# EAGLE design das_updated_v7 (EAGLE 9.6.2)
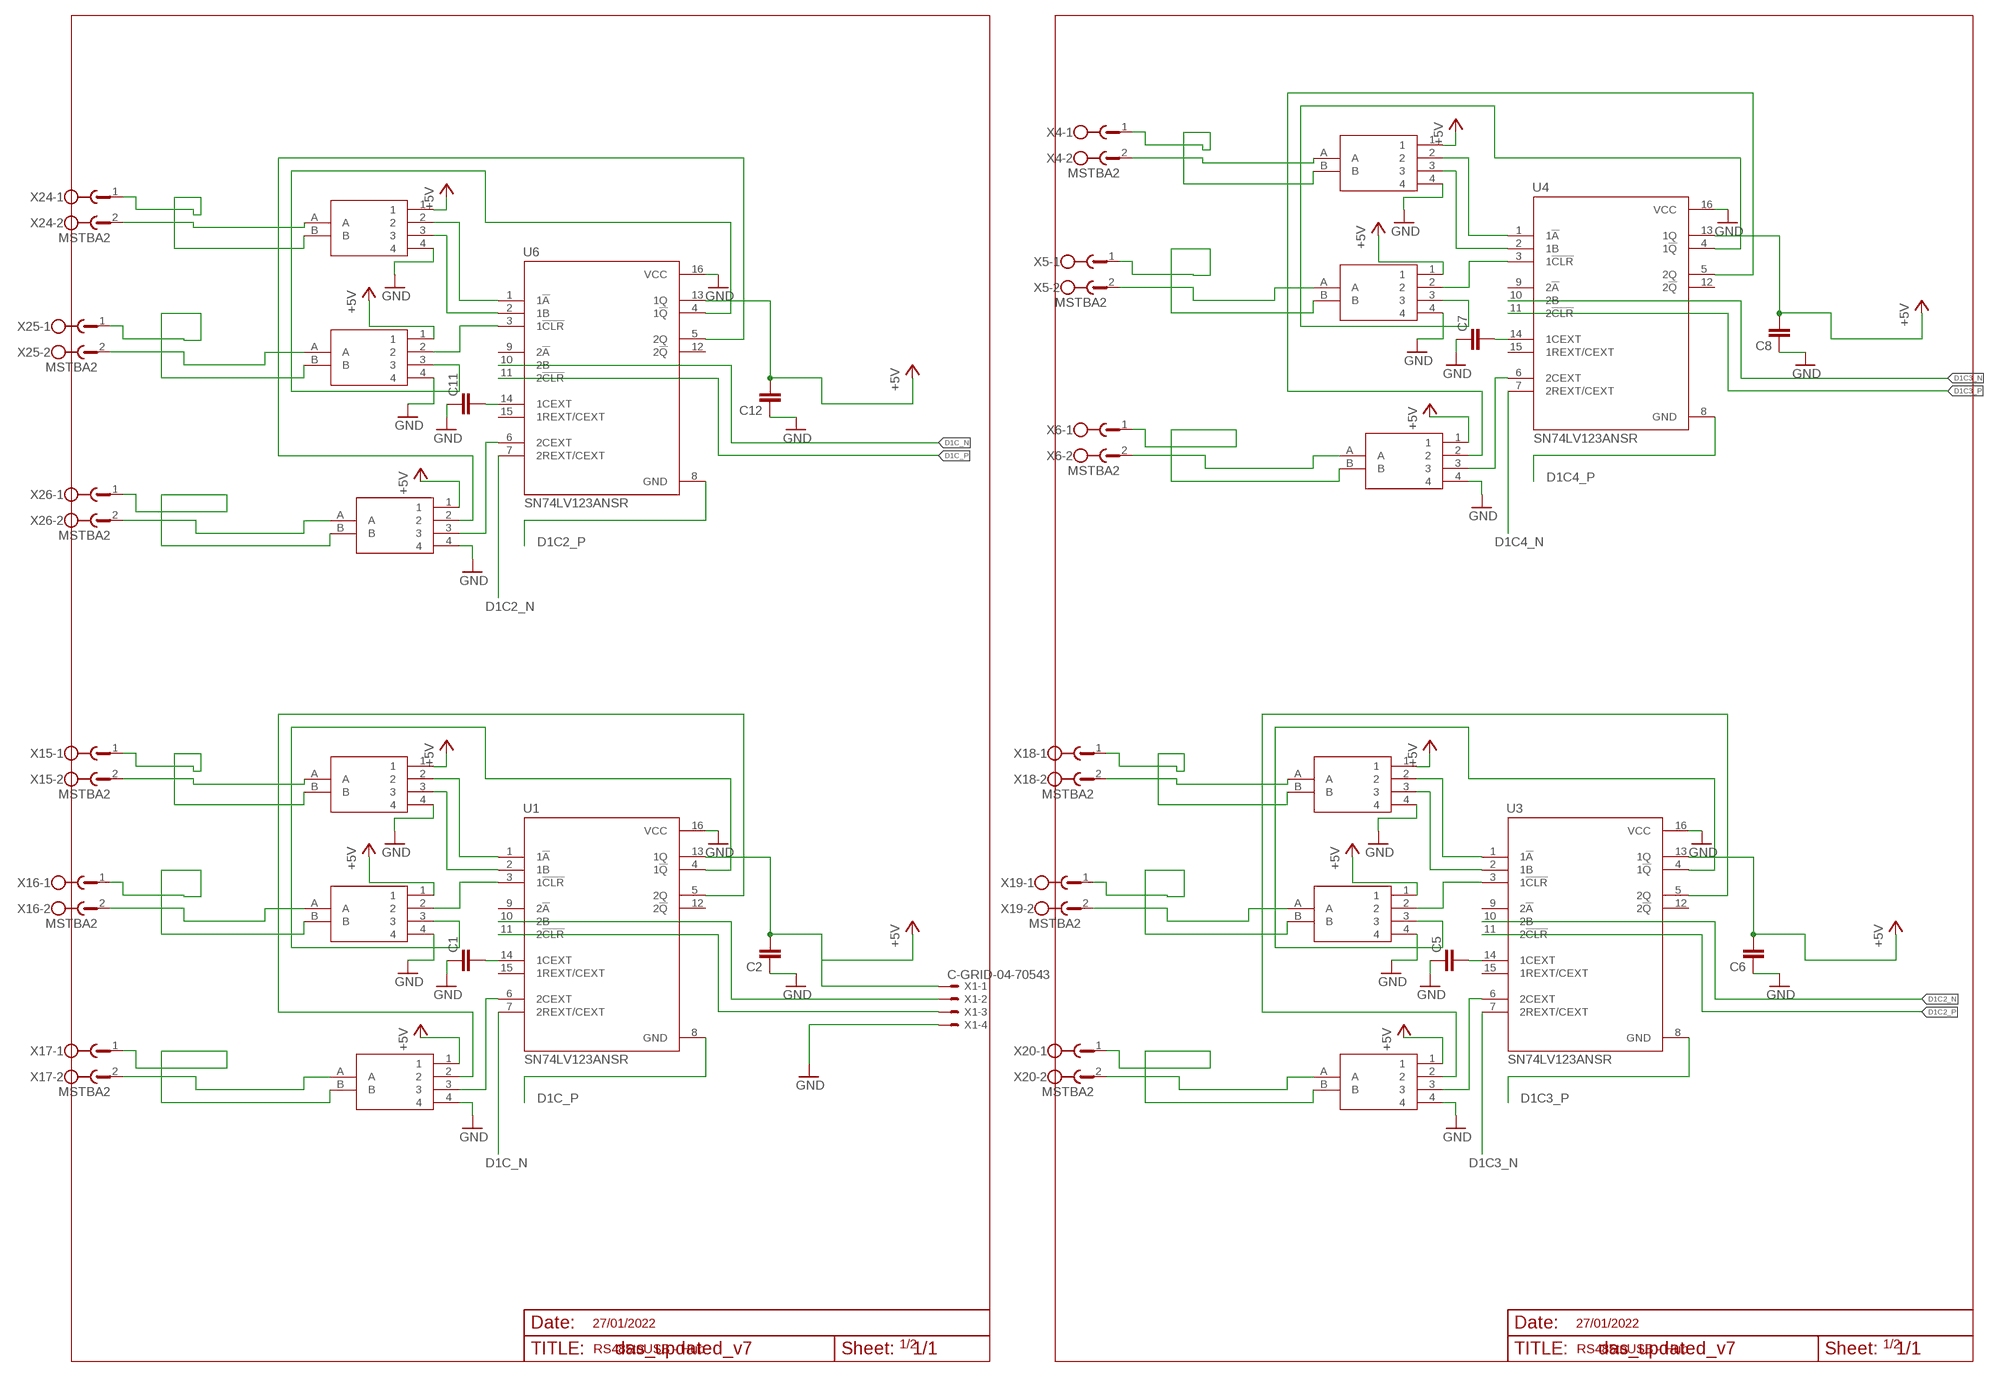
[diagram p0: schematic, sheet 1, part 1 of 2]
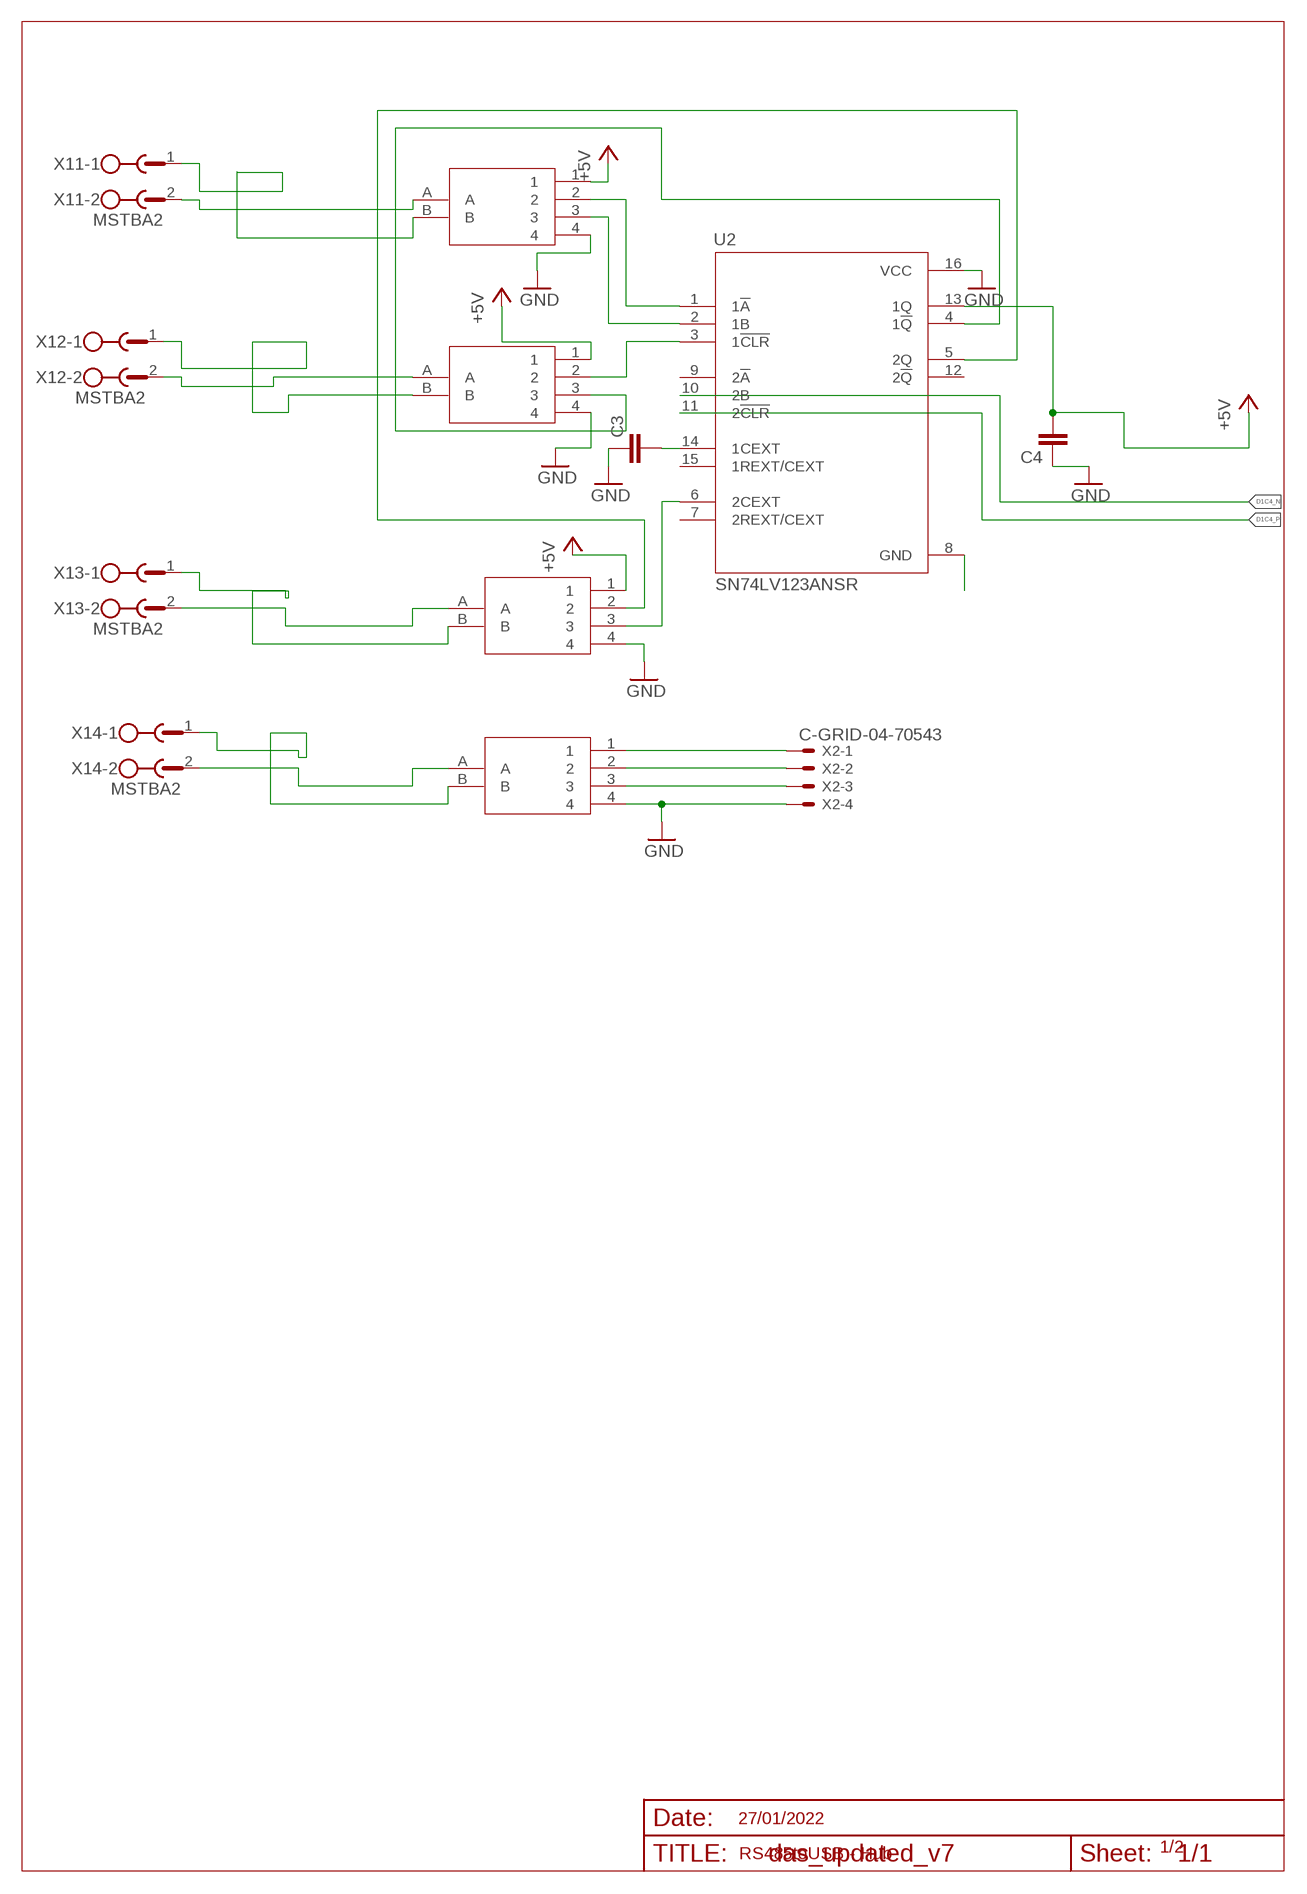
[diagram p1: schematic, sheet 1, part 2 of 2]

## Parts
C1  C-EUC0603K  [C0603K]
C2  C-EUC0603K  [C0603K]
C3  C-EUC0603K  [C0603K]
C4  C-EUC0603K  [C0603K]
C5  C-EUC0603K  [C0603K]
C6  C-EUC0603K  [C0603K]
C7  C-EUC0603K  [C0603K]
C8  C-EUC0603K  [C0603K]
C11  C-EUC0603K  [C0603K]
C12  C-EUC0603K  [C0603K]
U1  SN74LV123ANSR  [SOIC127P780X200-16N]
U2  SN74LV123ANSR  [SOIC127P780X200-16N]
U3  SN74LV123ANSR  [SOIC127P780X200-16N]
U4  SN74LV123ANSR  [SOIC127P780X200-16N]
U6  SN74LV123ANSR  [SOIC127P780X200-16N]
USB2RS1  USB2RS485  [USB2RS485]
USB2RS2  USB2RS485  [USB2RS485]
USB2RS3  USB2RS485  [USB2RS485]
USB2RS4  USB2RS485  [USB2RS485]
USB2RS5  USB2RS485  [USB2RS485]
USB2RS6  USB2RS485  [USB2RS485]
USB2RS7  USB2RS485  [USB2RS485]
USB2RS8  USB2RS485  [USB2RS485]
USB2RS9  USB2RS485  [USB2RS485]
USB2RS10  USB2RS485  [USB2RS485]
USB2RS11  USB2RS485  [USB2RS485]
USB2RS12  USB2RS485  [USB2RS485]
USB2RS13  USB2RS485  [USB2RS485]
USB2RS17  USB2RS485  [USB2RS485]
USB2RS18  USB2RS485  [USB2RS485]
USB2RS19  USB2RS485  [USB2RS485]
X1  C-GRID-04-70543  [70543-04]
X2  C-GRID-04-70543  [70543-04]
X4  MSTBA2  [MSTBA2]
X5  MSTBA2  [MSTBA2]
X6  MSTBA2  [MSTBA2]
X11  MSTBA2  [MSTBA2]
X12  MSTBA2  [MSTBA2]
X13  MSTBA2  [MSTBA2]
X14  MSTBA2  [MSTBA2]
X15  MSTBA2  [MSTBA2]
X16  MSTBA2  [MSTBA2]
X17  MSTBA2  [MSTBA2]
X18  MSTBA2  [MSTBA2]
X19  MSTBA2  [MSTBA2]
X20  MSTBA2  [MSTBA2]
X24  MSTBA2  [MSTBA2]
X25  MSTBA2  [MSTBA2]
X26  MSTBA2  [MSTBA2]

## Nets
+5V: C2.2 C4.2 C6.2 C8.2 C12.2 U1.13(1Q) U2.13(1Q) U3.13(1Q) U4.13(1Q) U6.13(1Q) USB2RS1.1 USB2RS2.1 USB2RS3.1 USB2RS4.1 USB2RS5.1 USB2RS6.1 USB2RS7.1 USB2RS9.1 USB2RS10.1 USB2RS11.1 USB2RS12.1 USB2RS13.1 USB2RS17.1 USB2RS18.1 USB2RS19.1 X1.1
D1C2_N [data]: U3.10(2B) U6.7(2REXT/CEXT)
D1C2_P [data]: U3.11(2!CLR) U6.8(GND)
D1C3_N [data]: U3.7(2REXT/CEXT) U4.10(2B)
D1C3_P [data]: U3.8(GND) U4.11(2!CLR)
D1C4_N [data]: U2.10(2B) U4.7(2REXT/CEXT)
D1C4_P [data]: U2.11(2!CLR) U4.8(GND)
D1C_N [data]: U1.7(2REXT/CEXT) U6.10(2B)
D1C_P [data]: U1.8(GND) U6.11(2!CLR)
D2- [data]: USB2RS8.2 X2.2
D_N [data]: U1.11(2!CLR) X1.3
D_P [data]: U1.10(2B) X1.2
GND: C1.1 C2.1 C3.1 C4.1 C5.1 C6.1 C7.1 C8.1 C11.1 C12.1 U1.16(VCC) U2.16(VCC) U3.16(VCC) U4.16(VCC) U6.16(VCC) USB2RS1.4 USB2RS2.4 USB2RS3.4 USB2RS4.4 USB2RS5.4 USB2RS6.4 USB2RS7.4 USB2RS8.4 USB2RS9.4 USB2RS10.4 USB2RS11.4 USB2RS12.4 USB2RS13.4 USB2RS17.4 USB2RS18.4 USB2RS19.4 X1.4 X2.4
MOD2_N [data]: U1.6(2CEXT) USB2RS3.3
MOD2_N1 [data]: U3.6(2CEXT) USB2RS10.3
MOD2_N2 [data]: U4.6(2CEXT) USB2RS13.3
MOD2_N4 [data]: U6.6(2CEXT) USB2RS19.3
MOD2_P [data]: U1.5(2Q) USB2RS3.2
MOD2_P1 [data]: U3.5(2Q) USB2RS10.2
MOD2_P2 [data]: U4.5(2Q) USB2RS13.2
MOD2_P4 [data]: U6.5(2Q) USB2RS19.2
MOD3_N [data]: U1.4(1!Q) USB2RS2.3
MOD3_N1 [data]: U3.4(1!Q) USB2RS9.3
MOD3_N2 [data]: U4.4(1!Q) USB2RS12.3
MOD3_N4 [data]: U6.4(1!Q) USB2RS18.3
MOD3_P [data]: U1.3(1!CLR) USB2RS2.2
MOD3_P1 [data]: U3.3(1!CLR) USB2RS9.2
MOD3_P2 [data]: U4.3(1!CLR) USB2RS12.2
MOD3_P4 [data]: U6.3(1!CLR) USB2RS18.2
MOD4_N [data]: U1.2(1B) USB2RS1.3
MOD4_N1 [data]: U3.2(1B) USB2RS4.3
MOD4_N2 [data]: U4.2(1B) USB2RS11.3
MOD4_N4 [data]: U6.2(1B) USB2RS17.3
MOD4_P [data]: U1.1(1!A) USB2RS1.2
MOD4_P1 [data]: U3.1(1!A) USB2RS4.2
MOD4_P2 [data]: U4.1(1!A) USB2RS11.2
MOD4_P4 [data]: U6.1(1!A) USB2RS17.2
MOD7_N [data]: U2.6(2CEXT) USB2RS7.3
MOD7_P [data]: U2.5(2Q) USB2RS7.2
MOD8_N [data]: U2.4(1!Q) USB2RS6.3
MOD8_P [data]: U2.3(1!CLR) USB2RS6.2
MOD9_N [data]: U2.2(1B) USB2RS5.3
MOD9_P [data]: U2.1(1!A) USB2RS5.2
N$1: C5.2 U3.14(1CEXT)
N$2: C7.2 U4.14(1CEXT)
N$3: U2.8(GND)
N$5 [data]: USB2RS8.3 X2.3
N$6: C11.2 U6.14(1CEXT)
N$7: C1.2 U1.14(1CEXT)
N$8: USB2RS8.1 X2.1
N$17: C3.2 U2.14(1CEXT)
X2_N [data]: USB2RS3.B X17.1
X2_N1 [data]: USB2RS10.B X20.1
X2_N2 [data]: USB2RS13.B X6.1
X2_N4 [data]: USB2RS19.B X26.1
X2_P [data]: USB2RS3.A X17.2
X2_P1 [data]: USB2RS10.A X20.2
X2_P2 [data]: USB2RS13.A X6.2
X2_P4 [data]: USB2RS19.A X26.2
X3_N [data]: USB2RS2.B X16.1
X3_N1 [data]: USB2RS9.B X19.1
X3_N2 [data]: USB2RS12.B X5.1
X3_N4 [data]: USB2RS18.B X25.1
X3_P [data]: USB2RS2.A X16.2
X3_P1 [data]: USB2RS9.A X19.2
X3_P2 [data]: USB2RS12.A X5.2
X3_P4 [data]: USB2RS18.A X25.2
X4_N [data]: USB2RS1.B X15.1
X4_N1 [data]: USB2RS4.B X18.1
X4_N2 [data]: USB2RS11.B X4.1
X4_N4 [data]: USB2RS17.B X24.1
X4_P [data]: USB2RS1.A X15.2
X4_P1 [data]: USB2RS4.A X18.2
X4_P2 [data]: USB2RS11.A X4.2
X4_P4 [data]: USB2RS17.A X24.2
X5_N [data]: USB2RS8.B X14.1
X5_P [data]: USB2RS8.A X14.2
X6_N [data]: USB2RS7.B X13.1
X6_P [data]: USB2RS7.A X13.2
X7_N [data]: USB2RS6.B X12.1
X7_P [data]: USB2RS6.A X12.2
X8_N [data]: USB2RS5.B X11.1
X8_P [data]: USB2RS5.A X11.2
Unconnected: U1.9(2!A) U1.12(2!Q) U1.15(1REXT/CEXT) U2.7(2REXT/CEXT) U2.9(2!A) U2.12(2!Q) U2.15(1REXT/CEXT) U3.9(2!A) U3.12(2!Q) U3.15(1REXT/CEXT) U4.9(2!A) U4.12(2!Q) U4.15(1REXT/CEXT) U6.9(2!A) U6.12(2!Q) U6.15(1REXT/CEXT)

## Notes on the sheet
- 27/01/2022
- 27/01/2022 | 27/01/2022
- 1/2
- RS485toUSB - Hub
- 1/2 | 1/2
- RS485toUSB - Hub | RS485toUSB - Hub

## Library data of the parts
C1-C8 C11 C12 = resistor:C-EU: CAPACITOR, European symbol
U1-U4 U6 = SN74LV123ANSR:SN74LV123ANSR: Monostable Multivibrator 13ns 16-SO Check prices <https://pricing.snapeda.com/parts/SN74LV123ANSR/Texas%20Instruments/view-part?ref=eda>; AVAILABILITY: In Stock; DESCRIPTION: Dual Retriggerable Monostable Multivibrators 16-SO -40 to 125; MF: Texas Instruments; MP: SN74LV123ANSR; PACKAGE: SOP-16 Texas Instruments; PRICE: None; PURCHASE-URL: https://pricing.snapeda.com/search/part/SN74LV123ANSR/?ref=eda
USB2RS1-USB2RS13 USB2RS17-USB2RS19 = USB2RS485:USB2RS485
X1 X2 = con-molex:C-GRID-04: CONNECTOR wire to board 2.54 mm (0.100") pitch header; MF: MOLEX; OC_FARNELL: unknown; OC_NEWARK: unknown
X4-X6 X11-X20 X24-X26 = con-phoenix-508:MSTBA2: PHOENIX; MF: FARNELL; MPN: 1757242; OC_FARNELL: 3705171; OC_NEWARK: 71C4161

## Net classes
0 default: clearance 0.305 mm
1 data: width 0.127 mm, clearance 0.305 mm

## Board
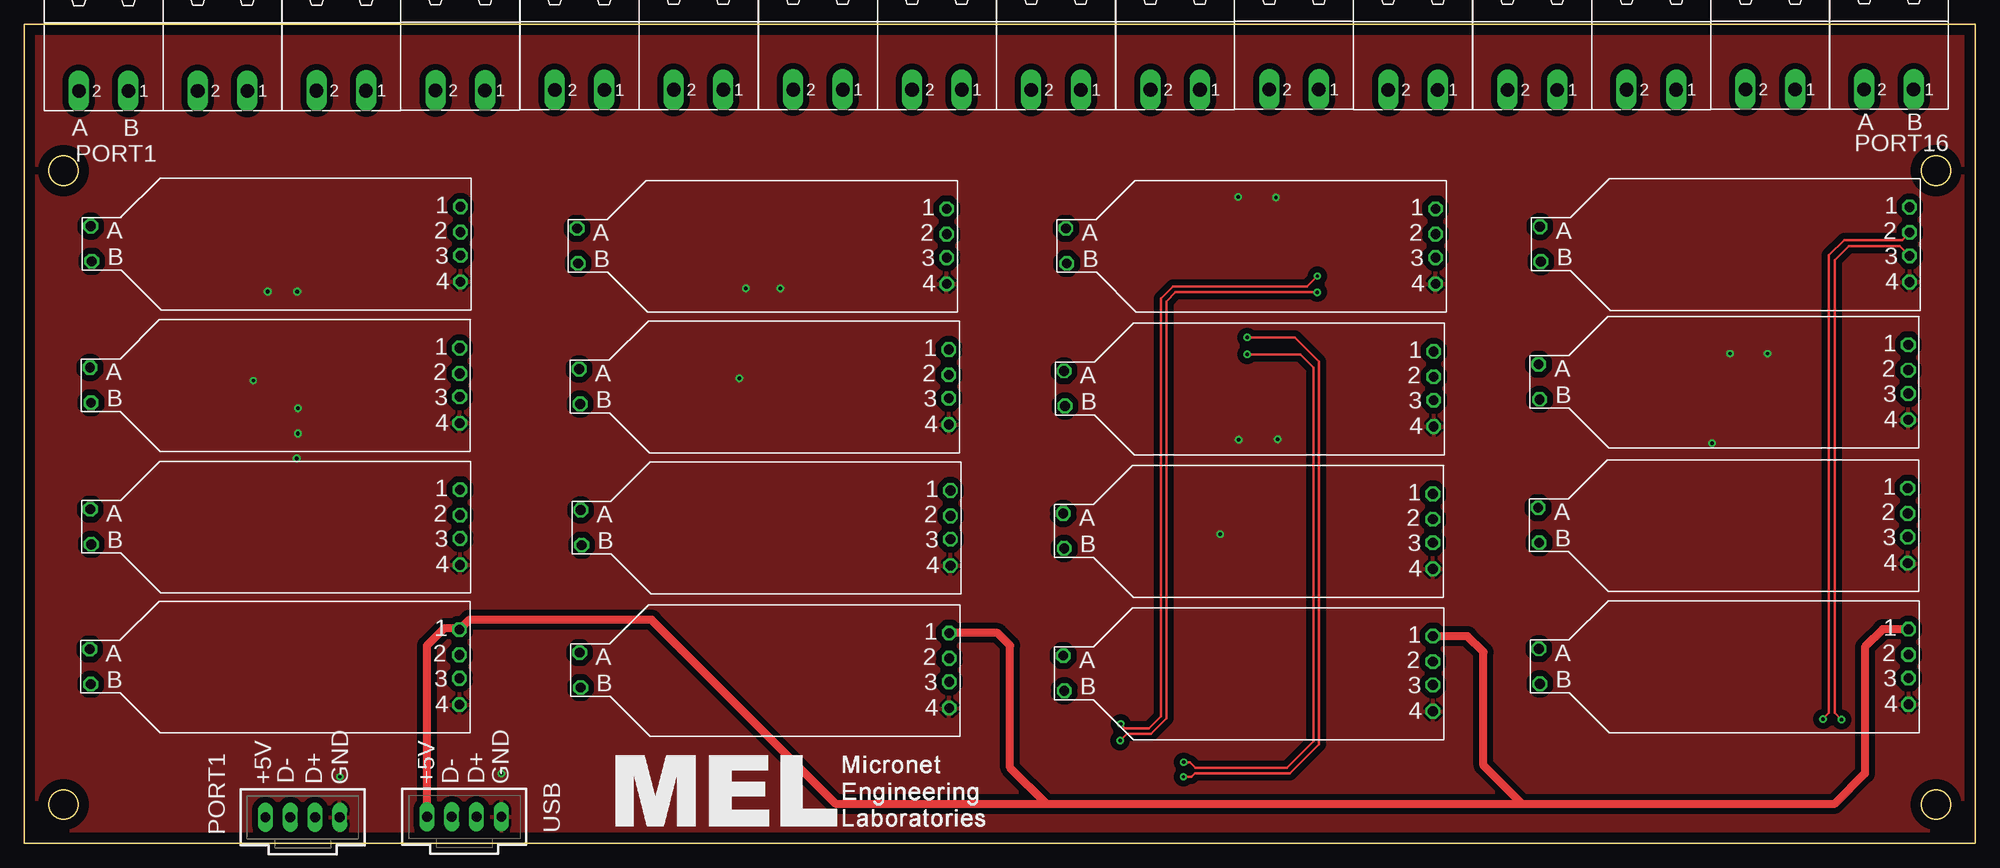
[diagram p2: board, top side]
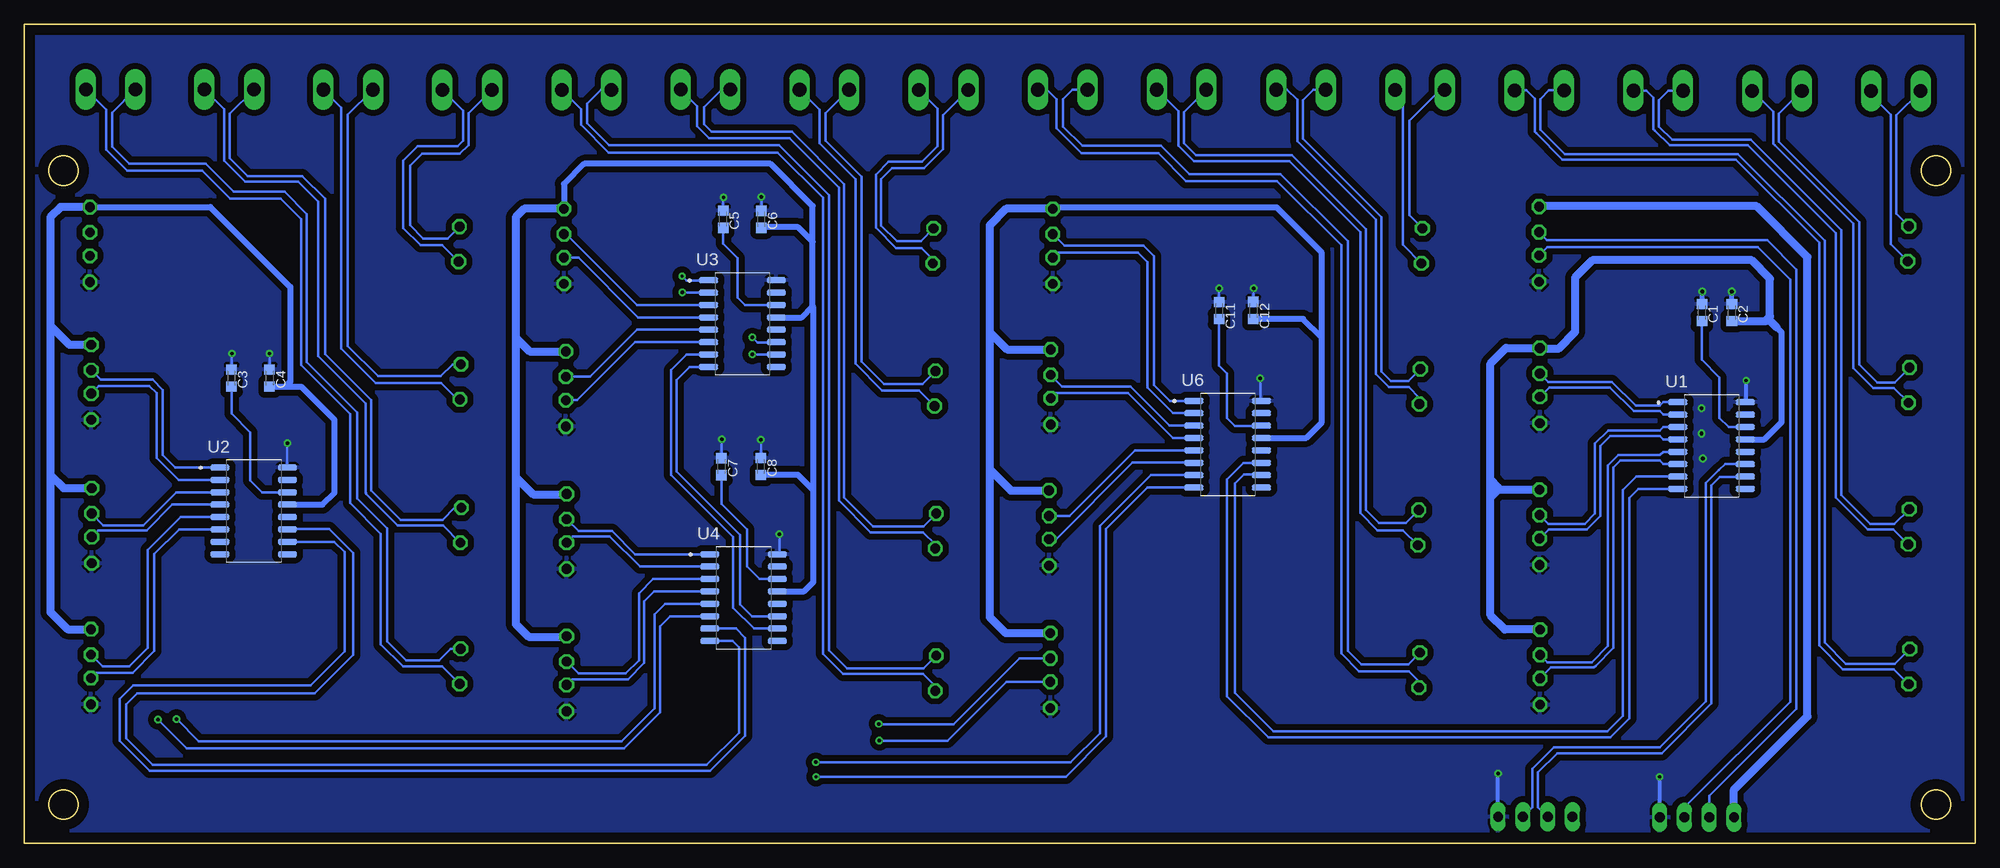
[diagram p3: board, bottom side, seen from below]

Size 200 x 84 mm. Coordinates in mm from the lower left corner, seen from the top.
Outline: 0,84 200,84 200,0 0,0 0,84
Outline: circle at 4,69 radius 1.5
Outline: circle at 4,4 radius 1.5
Outline: circle at 196,4 radius 1.5
Outline: circle at 196,69 radius 1.5
Copper layers (1*16): Top 0.035mm / dielectric 1.5mm / Bottom 0.035mm
Design rules "default": minimum track width 6mil, minimum drill 0.35mm, track to track 6mil, track to pad 6mil, pad to pad 6mil, via to via 6mil, smd to smd 6mil, copper to edge 40mil, drill to drill 6mil, minimum pad ring 10mil, minimum via ring 8mil, stop-mask expansion 4mil, vias tented up to drill 0mil, thermal gap 10mil

### Footprints (pad centres in the part's own frame; a part is rotated, then mirrored left to right if it is on the bottom)
C0603K = smd 1.05 x 1.08: 1 -0.875,0; 2 0.875,0
SOIC127P780X200-16N = smd 1.97 x 0.61: 1 -3.465,4.445; 2 -3.465,3.175; 3 -3.465,1.905; 4 -3.465,0.635; 5 -3.465,-0.635; 6 -3.465,-1.905; 7 -3.465,-3.175; 8 -3.465,-4.445; 9 3.465,-4.445; 10 3.465,-3.175; 11 3.465,-1.905; 12 3.465,-0.635; 13 3.465,0.635; 14 3.465,1.905; 15 3.465,3.175; 16 3.465,4.445
USB2RS485 = drill 1 pad 1.422 octagon: 1 36.9,3.6; 2 36.9,1; 3 36.9,-1.4; 4 36.9,-4.1; A -1,1.6; B -0.9,-2
70543-04 = drill 1.016 long: 1 -3.81,0; 2 -1.27,0; 3 1.27,0; 4 3.81,0
MSTBA2 = drill 1.397 long: 1 -2.54,5.08; 2 2.54,5.08

### Placement (x,y rotation side)
C1  28.01,54.44 270 bottom
C2  24.94,54.44 270 bottom
C3  178.77,47.73 270 bottom
C4  174.86,47.73 270 bottom
C5  128.36,64.01 270 bottom
C6  124.44,64.01 270 bottom
C7  128.52,38.64 270 bottom
C8  124.49,38.67 270 bottom
C11  77.51,54.65 270 bottom
C12  74,54.66 270 bottom
U1  27.02,40.8 0 bottom
U2  176.5,34.11 0 bottom
U3  126.38,53.32 0 bottom
U4  126.27,25.21 0 bottom
U6  76.63,40.95 0 bottom
USB2RS1  7.72,47.2 0 top
USB2RS2  7.76,32.67 0 top
USB2RS3  7.7,18.33 0 top
USB2RS4  57.92,17.97 0 top
USB2RS5  156.25,47.54 0 top
USB2RS6  156.2,32.84 0 top
USB2RS7  156.28,18.36 0 top
USB2RS8  7.81,61.7 0 top
USB2RS9  107.78,61.49 0 top
USB2RS10  107.6,46.86 0 top
USB2RS11  107.51,32.24 0 top
USB2RS12  107.52,17.65 0 top
USB2RS13  156.39,61.67 0 top
USB2RS17  57.66,61.48 0 top
USB2RS18  57.87,47.05 0 top
USB2RS19  58.04,32.59 0 top
X1  45.1,2.73 0 top
X2  28.52,2.68 0 top
X4  130.18,82.39 180 top
X5  142.36,82.37 180 top
X6  154.6,82.36 180 top
X11  166.81,82.38 180 top
X12  179,82.41 180 top
X13  191.16,82.41 180 top
X14  8.13,82.25 180 top
X15  20.31,82.26 180 top
X16  32.49,82.28 180 top
X17  44.68,82.3 180 top
X18  93.55,82.38 180 top
X19  105.76,82.36 180 top
X20  117.99,82.37 180 top
X24  56.91,82.35 180 top
X25  69.11,82.38 180 top
X26  81.36,82.38 180 top

### Tracks (layer width: path | path; a pad name or v marks a point on that pad's centre or on a via)
+5V
  Top 0.813: USB2RS7.1 190.53,21.96 188.71,20.14 188.71,7.18 185.54,4.02 153.58,4.02 | 153.58,4.02 149.6,8 149.6,19.62 147.97,21.25 USB2RS12.1 | 153.58,4.02 104.82,4.02 | 104.82,4.02 101.07,7.77 101.07,20.3 99.79,21.58 USB2RS4.1 | 104.82,4.02 83.22,4.02 64.31,22.93 45.6,22.93 USB2RS3.1 44.77,22.1 43.1,22.1 41.28,20.28 X1.1
  Bottom 0.61: U1.13 21.59,41.44 19.83,43.2 19.83,52.41 20.37,52.94 | U6.13 68.58,41.58 66.97,43.18 66.97,51.86 | C12.2 68.9,53.79 66.97,51.86 | 66.97,51.86 66.97,60.59 71.6,65.22 94.42,65.22 USB2RS17.1 | U3.13 120.31,53.95 119.18,55.08 | 119.18,55.08 119.18,61.71 | 119.18,61.71 120.66,63.19 124.39,63.19 C6.2 | 119.18,61.71 119.18,65.37 123.51,69.7 142.6,69.7 144.68,67.62 USB2RS9.1 | U4.13 120.05,25.85 119.1,26.8 119.1,36.21 | C8.2 120.68,37.79 119.1,36.21 | 119.1,36.21 119.1,55 119.18,55.08 | U2.13 169.43,34.74 168.21,35.96 168.21,43.45 171.62,46.85 173.25,46.85 | C4.2 173.25,46.85 | USB2RS13.1 180.94,65.27 172.74,57.07 172.74,47.37 173.25,46.85
  Bottom 0.813: C2.2 21.52,53.56 | 21.52,53.56 21.03,54.05 21.03,57.93 22.92,59.82 39.23,59.82 41.02,58.02 41.02,52.45 42.74,50.73 44.55,50.73 USB2RS1.1 44.63,50.8 48.09,50.8 49.7,49.2 49.7,37.3 | 21.52,53.56 20.99,53.56 20.37,52.94 | USB2RS3.1 48.23,21.93 49.7,23.4 49.7,35.49 | 49.7,35.49 49.7,36.84 | 49.7,36.84 49.7,37.3 | USB2RS2.1 48.91,36.27 | 48.91,36.27 49.7,35.49 | 48.91,36.27 49.13,36.27 49.7,36.84 | 49.7,37.3 48.91,36.52 48.91,36.27 | USB2RS17.1 99.34,65.08 101.05,63.38 101.05,52.45 | 101.05,52.45 99.25,50.65 USB2RS18.1 | 101.05,52.45 101.05,38.38 | USB2RS19.1 98.86,36.19 101.05,38.38 | 101.05,38.38 101.05,23.23 99.4,21.58 USB2RS4.1 | USB2RS9.1 148.75,65.09 149.62,64.22 149.62,51.89 | 149.62,51.89 148.18,50.45 USB2RS10.1 | 149.62,51.89 149.62,37.59 | 149.62,37.59 147.83,35.8 144.45,35.8 USB2RS11.1 | 149.62,37.59 149.62,22.51 148.29,21.19 144.48,21.19 USB2RS12.1 | USB2RS13.1 196.29,65.27 197.35,64.21 197.35,53.1 | USB2RS5.1 195.39,51.14 197.35,53.1 | 197.35,53.1 197.35,37.8 | USB2RS6.1 195.98,36.44 197.35,37.8 | 197.35,37.8 197.35,23.74 195.57,21.96 USB2RS7.1
D1C2_N  (via drill 0.35)
  Top 0.254: v118.86,8.32 119.51,8.32 120.05,7.78 129.46,7.78 132.18,10.5 132.18,48.8 130.81,50.16 v125.37,50.16
  Bottom 0.254: U6.7 84.5,37.77 89.72,32.55 89.72,11.31 92.73,8.31 118.84,8.31 v118.86,8.32 | v125.37,50.16 125.35,50.14 U3.10
D1C2_P  (via drill 0.35)
  Top 0.254: v118.83,6.84 119.68,6.84 120.03,7.18 129.75,7.18 132.74,10.17 132.74,49.4 130.25,51.89 v125.35,51.89
  Bottom 0.254: U6.8 84.87,36.5 89.11,32.26 89.11,10.96 93.23,6.84 v118.83,6.84 | v125.35,51.89 124.84,51.37 122.96,51.37 U3.11
D1C3_N
  Bottom 0.254: U4.10 125.2,22.04 127.33,24.16 127.33,31.42 133.72,37.81 133.72,48.55 132.11,50.15 129.86,50.15 U3.7
D1C3_P
  Bottom 0.254: U4.11 125.41,23.31 126.62,24.52 126.62,31.65 133.12,38.16 133.12,47.54 131.79,48.87 U3.8
D1C4_N
  Bottom 0.254: U4.7 127.06,22.04 126.11,21.09 126.11,11.06 129.71,7.46 187.17,7.46 190.21,10.5 190.21,14.84 188.84,16.21 170.67,16.21 167.17,19.71 167.17,29.87 168.23,30.93 U2.10
D1C4_P
  Bottom 0.254: U4.8 127.39,20.77 126.75,20.12 126.75,11.36 130.03,8.07 186.82,8.07 189.54,10.79 189.54,14.26 188.42,15.38 170.26,15.38 166.28,19.35 166.28,29.79 168.74,32.24 172.99,32.24 U2.11
D1C_N
  Bottom 0.254: U1.7 34.72,37.63 36.11,36.23 36.11,13.1 37.69,11.52 71.95,11.52 75.89,15.46 75.89,36.92 74.98,37.83 73.23,37.83 U6.10
D1C_P
  Bottom 0.254: U1.8 34.53,36.36 35.43,35.45 35.43,12.85 37.42,10.86 72.47,10.86 76.71,15.1 76.71,37.34 75.01,39.04 U6.11
D2-
  Bottom 0.254: X2.2 27.26,4.87 18.33,13.8 18.33,58.88 21.33,61.88 43.88,61.88 USB2RS8.2
D_N
  Bottom 0.254: X1.3 45.38,3.72 45.38,7.67 43.2,9.85 32.33,9.85 27.61,14.58 27.61,36.95 26.27,38.29 | 26.27,38.29 | 26.27,38.29 25.63,38.92 23.58,38.92 U1.11
D_P
  Bottom 0.254: X1.2 44.82,3.72 44.82,7.27 42.83,9.26 32.13,9.26 27.05,14.34 27.05,36.72 26.16,37.6 23.58,37.6 U1.10
GND  (via drill 0.35, 0.4)
  Bottom 0.254: U1.16 | C12.1 74,56.92 v73.98,56.94 | C11.1 77.51,56.93 v77.49,56.94 | U6.16 73.3,45.52 v73.3,47.69 | C6.1 124.44,66.29 v124.43,66.31 | C5.1 128.36,66.23 v128.32,66.27 | U4.16 122.59,29.87 v122.59,31.7 | C8.1 124.49,41.38 124.51,41.4 | 124.51,41.4 | 124.51,41.4 v124.5,41.42 | C7.1 128.52,41.42 128.52,41.43 v128.49,41.43 | C4.1 174.86,50.2 174.88,50.22 v174.88,50.24 | C3.1 178.77,50.18 v178.71,50.24 | U2.16 173.03,41.03 v173.02,41.04
  Bottom 0.406: X2.4 32.34,6.81 v32.35,6.83 | X1.4 v48.91,7.15 48.89,7.17 | U1.16 23.46,45.34 v23.46,47.47
  Bottom 0.508: C2.1 v24.94,56.58 24.96,56.59 | C1.1 27.96,55.36 v27.96,56.59
  other vias: 28.04,44.64 28.05,42.05 27.93,39.48
  pour Top (isolate 0.61): 0,84 200,84 200,0 0,0
  pour Bottom (isolate 0.61): 0,84 200,84 200,0 0,0
MOD2_N
  Bottom 0.254: U1.6 31.98,38.9 32.33,39.25 36.35,39.25 37.07,38.53 37.07,20.03 38.9,18.2 | 38.9,18.2 | 38.9,18.2 39.07,18.03 43.5,18.03 USB2RS3.3
MOD2_N1
  Bottom 0.254: USB2RS10.3 143.33,45.46 137.38,51.41 U3.6
MOD2_N2  (via drill 0.35)
  Top 0.254: v186.3,12.69 185.59,13.39 185.59,59.8 187.06,61.27 192.29,61.27 USB2RS13.3
  Bottom 0.254: U4.6 133.79,23.31 134.82,22.27 134.82,13.45 138.5,9.77 183.38,9.77 v186.3,12.69
MOD2_N4
  Bottom 0.254: USB2RS19.3 94.26,31.19 86.37,39.08 80.13,39.08 U6.6
MOD2_P
  Bottom 0.254: U1.5 31.98,40.17 32.33,39.81 36.58,39.81 37.63,38.76 37.63,20.26 39.3,18.59 43.87,18.59 USB2RS3.2
MOD2_P1
  Bottom 0.254: USB2RS10.2 142.01,47.86 137.19,52.68 U3.5
MOD2_P2  (via drill 0.35)
  Top 0.254: v184.4,12.76 185.02,13.37 185.02,60.31 186.6,61.89 192.52,61.89 USB2RS13.2
  Bottom 0.254: U4.5 134.31,24.58 135.38,23.51 135.38,13.85 138.77,10.46 182.1,10.46 v184.4,12.76
MOD2_P4
  Bottom 0.254: USB2RS19.2 92.87,33.59 86.16,40.31 U6.5
MOD3_N
  Bottom 0.254: U1.4 31.98,41.44 32.33,41.79 37.39,41.79 38.41,40.78 38.41,33.59 39.79,32.2 43.73,32.2 USB2RS2.3
MOD3_N1
  Bottom 0.254: U3.4 137.06,53.95 143.19,60.09 USB2RS9.3
MOD3_N2
  Bottom 0.254: U4.4 135.42,25.85 136.44,24.82 136.44,18.5 138.11,16.83 143.83,16.83 USB2RS12.3
MOD3_N4
  Bottom 0.254: U6.4 82.23,41.58 86.87,46.22 94.21,46.22 USB2RS18.3
MOD3_P
  Bottom 0.254: U1.3 31.98,42.71 32.33,42.35 37.62,42.35 38.97,41.01 38.97,33.82 40,32.78 43.77,32.78 USB2RS2.2
MOD3_P1
  Bottom 0.254: U3.3 137.2,55.22 144.47,62.49 USB2RS9.2
MOD3_P2
  Bottom 0.254: U4.3 135.53,27.12 137,25.65 137,18.79 138.36,17.43 143.2,17.43 USB2RS12.2
MOD3_P4
  Bottom 0.254: U6.3 82.59,42.85 86.61,46.88 93.59,46.88 USB2RS18.2
MOD4_N
  Bottom 0.254: U1.2 31.98,43.98 32.33,44.33 35.01,44.33 37.45,46.77 42.73,46.77 42.89,46.77 43.65,46.77 USB2RS1.3
MOD4_N1  (via drill 0.35)
  Top 0.254: v112.34,10.54 113.03,11.23 115.48,11.23 117.08,12.83 117.08,12.88 | 117.08,12.88 | 117.08,12.88 117.08,55.57 118.04,56.53 v132.55,56.53
  Bottom 0.254: USB2RS4.3 99.32,16.57 105.36,10.54 v112.34,10.54 | v132.55,56.53 132.51,56.49 U3.2
MOD4_N2
  Bottom 0.254: U4.2 136.9,28.39 139.98,31.47 143.78,31.47 USB2RS11.3
MOD4_N4
  Bottom 0.254: U6.2 82.25,44.12 84.88,46.75 84.88,59.62 85.85,60.59 94.05,60.59 USB2RS17.3
MOD4_P
  Bottom 0.254: U1.1 31.98,45.25 32.33,44.89 34.78,44.89 37.22,47.33 42.86,47.33 42.89,47.33 43.76,47.33 USB2RS1.2
MOD4_P1  (via drill 0.35)
  Top 0.254: v112.4,12.26 112.84,11.81 115.27,11.81 116.52,13.06 116.52,55.87 117.77,57.13 131.51,57.13 v132.57,58.19
  Bottom 0.254: USB2RS4.2 97.98,18.98 104.74,12.22 112.35,12.22 v112.4,12.26 | v132.57,58.19 132.12,57.73 129.88,57.73 U3.1
MOD4_P2
  Bottom 0.254: U4.1 137.38,29.66 139.75,32.03 143.2,32.03 USB2RS11.2
MOD4_P4
  Bottom 0.254: U6.1 82.57,45.39 84.21,47.03 84.21,60.23 85.28,61.31 93.38,61.31 USB2RS17.2
MOD7_N
  Bottom 0.254: U2.6 184.15,32.2 186.66,29.69 186.66,19.73 188.9,17.5 192.65,17.5 USB2RS7.3
MOD7_P
  Bottom 0.254: U2.5 183.97,33.47 187.34,30.1 187.34,20.05 189.23,18.16 191.97,18.16 USB2RS7.2
MOD8_N
  Bottom 0.254: U2.4 184.84,34.74 187.48,32.1 187.54,32.1 187.57,32.08 192.13,32.08 192.16,32.1 192.43,32.1 USB2RS6.3
MOD8_P
  Bottom 0.254: U2.3 184.42,36.01 187.8,32.63 191.9,32.63 USB2RS6.2
MOD9_N
  Bottom 0.254: U2.2 184.19,37.28 186.45,39.54 186.45,46.18 187.19,46.92 192.36,46.92 USB2RS5.3
MOD9_P
  Bottom 0.254: U2.1 184.53,38.55 185.79,39.82 185.79,46.52 186.84,47.57 192.18,47.57 USB2RS5.2
N$1
  Bottom 0.254: C5.2 128.36,61.53 126.88,60.05 126.88,55.97 126.13,55.22 U3.14
N$2
  Bottom 0.254: C7.2 128.52,34.8 125.92,32.19 125.92,28.41 124.62,27.12 U4.14
N$5
  Bottom 0.254: X2.3 29.8,3.69 18.96,14.53 18.96,57.84 22.27,61.15 43.86,61.15 USB2RS8.3
N$6
  Bottom 0.254: C11.2 77.51,49.02 76.69,48.19 76.69,43.64 75.87,42.82 73.19,42.82 U6.14
N$7
  Bottom 0.254: C1.2 28.01,49.62 26.2,47.8 26.2,43.64 25.27,42.71 U1.14
N$8
  Bottom 0.813: X2.1 24.72,5.5 17.19,13.02 17.19,60.13 22.41,65.35 44.66,65.35 USB2RS8.1
N$17
  Bottom 0.254: C3.2 178.77,44.07 176.83,42.12 176.83,37.23 175.6,36.01 U2.14
X2_N
  Bottom 0.254: USB2RS3.B 8.32,17.85 13.54,17.85 15.99,20.29 15.99,61.59 24.54,70.15 42.31,70.15 44.99,72.82 | 44.99,72.82 | 44.99,72.82 45.15,72.99 45.15,76.36 46.02,77.23 X17.1
X2_N1
  Bottom 0.254: USB2RS10.B 108.29,46.45 112.07,46.45 114.81,49.19 114.81,68.15 118.49,71.83 118.49,75.25 X20.1
X2_N2
  Bottom 0.254: USB2RS13.B 157.16,61.34 159.38,61.34 161.16,63.12 161.16,70.03 159.71,71.49 155.59,71.49 155.03,72.05 155.03,75.16 X6.1
X2_N4
  Bottom 0.254: USB2RS19.B 58.66,32.11 61.27,32.11 63.03,33.87 63.03,62.69 70.29,69.95 80.1,69.95 81.7,71.55 81.7,75.11 X26.1
X2_P
  Bottom 0.254: USB2RS3.A 8.22,18.41 13.24,18.41 15.43,20.59 15.43,61.83 24.31,70.7 42.08,70.7 44.59,73.22 44.59,76.33 43.7,77.22 X17.2
X2_P1
  Bottom 0.254: USB2RS10.A 107.92,47.14 111.87,47.14 114.17,49.44 114.17,68.36 117.87,72.06 117.87,74.87 X20.2
X2_P2
  Bottom 0.254: USB2RS13.A 156.61,62.04 159.1,62.04 160.46,63.4 160.46,69.51 159.22,70.74 155.35,70.74 154.47,71.62 154.47,74.87 X6.2
X2_P4
  Bottom 0.254: USB2RS19.A 58.38,32.85 61.15,32.85 62.47,34.17 62.47,63.02 70.03,70.59 79.9,70.59 81.12,71.8 81.12,75 X26.2
X3_N
  Bottom 0.254: USB2RS2.B 8.38,32.2 11,32.2 14.3,35.48 14.3,62.6 23.29,71.59 31.29,71.59 32.81,73.11 | 32.81,73.11 | 32.81,73.11 32.98,73.28 32.98,76.47 32.97,76.47 33.71,77.2 X16.1
X3_N1
  Bottom 0.254: USB2RS9.B 106.88,59.92 108.03,61.08 110.64,61.08 112.71,63.15 112.71,68.59 111.39,69.92 107.96,69.92 106.37,71.5 106.37,75.35 X19.1
X3_N2
  Bottom 0.254: USB2RS12.B 106.62,16.15 107.86,17.4 116.08,17.4 118.12,19.44 118.12,66.22 122.77,70.86 140.09,70.86 142.93,73.71 142.93,75.32 X5.1
X3_N4
  Bottom 0.254: USB2RS18.B 56.97,45.7 58.07,46.79 60.11,46.79 61.44,48.13 61.44,63.96 69.49,72.01 69.49,76.25 70.53,77.3 X25.1
X3_P
  Bottom 0.254: USB2RS2.A 8.28,32.75 10.77,32.75 13.74,35.72 13.74,62.89 22.99,72.15 31.06,72.15 32.42,73.51 32.42,76.24 31.45,77.2 X16.2
X3_P1
  Bottom 0.254: USB2RS9.A 108.09,61.77 110.54,61.77 112.15,63.38 112.15,68.14 111.06,69.24 107.76,69.24 105.81,71.18 105.81,74.69 X19.2
X3_P2
  Bottom 0.254: USB2RS12.A 107.81,17.96 115.65,17.96 117.49,19.79 117.49,66.5 122.62,71.63 140.05,71.63 142.28,73.87 142.28,75.87 140.87,77.29 X5.2
X3_P4
  Bottom 0.254: USB2RS18.A 58.09,47.43 59.9,47.43 60.88,48.41 60.88,64.23 68.93,72.28 68.93,76.2 67.84,77.3 X25.2
X4_N
  Bottom 0.254: USB2RS1.B 8.34,46.72 10.43,46.72 12.49,48.77 12.49,63.54 20.56,71.61 | 20.56,71.61 | 20.56,71.61 20.7,71.75 20.7,75.02 X15.1
X4_N1
  Bottom 0.254: USB2RS4.B 57.02,16.63 58.05,17.66 63.16,17.66 64.97,19.47 64.97,61.36 71.56,67.94 80.89,67.94 83.73,70.79 91.62,70.79 94.17,73.33 94.17,76.3 95.17,77.3 X18.1
X4_N2
  Bottom 0.254: USB2RS11.B 106.61,30.66 107.84,31.9 113.23,31.9 116.5,35.17 116.5,67.28 121.54,72.32 129.8,72.32 131.02,73.54 131.02,75.61 X4.1
X4_N4
  Bottom 0.254: USB2RS17.B 58.69,61.41 58.69,76.5 X24.1
X4_P
  Bottom 0.254: USB2RS1.A 8.25,47.28 10.01,47.28 11.86,49.12 11.86,63.7 20.14,71.98 20.14,74.82 X15.2
X4_P1
  Bottom 0.254: USB2RS4.A 58.11,18.38 62.92,18.38 64.32,19.77 64.32,61.75 71.22,68.66 80.56,68.66 83.46,71.55 91.52,71.55 93.5,73.53 93.5,76.32 92.52,77.3 X18.2
X4_P2
  Bottom 0.254: USB2RS11.A 107.83,32.52 112.97,32.52 115.94,35.49 115.94,67.61 121.31,72.98 129.53,72.98 130.31,73.77 130.31,75.51 128.51,77.31 X4.2
X4_P4
  Bottom 0.254: USB2RS17.A 58,64.43 58,74.12 54.86,77.27 X24.2
X5_N
  Bottom 0.254: USB2RS8.B 8.65,61.45 8.65,74.71 10.67,76.73 X14.1
X5_P
  Bottom 0.254: USB2RS8.A 8.09,64.59 8.09,74.67 X14.2
X6_N
  Bottom 0.254: USB2RS7.B 157.18,18.16 161.19,18.16 163.46,20.43 163.46,31.76 166.62,34.92 166.62,44.04 171.63,49.05 171.63,64.04 173.71,66.12 178.9,66.12 181.79,69 189.47,69 191.63,71.17 191.63,75.26 X13.1
X6_P
  Bottom 0.254: USB2RS7.A 156.29,19.96 157.46,18.79 160.87,18.79 162.81,20.73 162.81,32.28 165.89,35.36 165.89,44.2 171.06,49.37 171.06,64.55 173.33,66.82 178.53,66.82 181.43,69.72 189.27,69.72 190.99,71.44 190.99,74.96 X13.2
X7_N
  Bottom 0.254: USB2RS6.B 157.07,32.6 161.71,32.6 164.96,35.85 164.96,35.93 165,35.96 165,45.13 169.86,49.99 169.86,65.82 171.91,67.88 177.35,67.88 179.49,70.02 179.49,70.06 179.5,70.06 179.5,75.08 179.49,75.08 179.49,75.28 X12.1
X7_P
  Bottom 0.254: USB2RS6.A 155.91,34.44 157.14,33.2 161.45,33.2 164.44,36.19 164.44,45.45 169.19,50.2 169.19,66.11 171.53,68.45 177.1,68.45 178.94,70.29 178.94,74.85 X12.2
X8_N
  Bottom 0.254: USB2RS5.B 155.58,45.54 157.26,47.22 163.99,47.22 167.52,50.76 167.52,75.48 X11.1
X8_P
  Bottom 0.254: USB2RS5.A 156.09,49.14 157.32,47.91 163.75,47.91 166.84,51 166.84,74.73 X11.2

### Text on the board
tNames: A | B | A | B | PORT16 | PORT1 | +5V | D- | D+ | GND | +5V | D- | D+ | GND | PORT1 | USB